# Altium schematic sheet SheetADC.SchDoc
size A
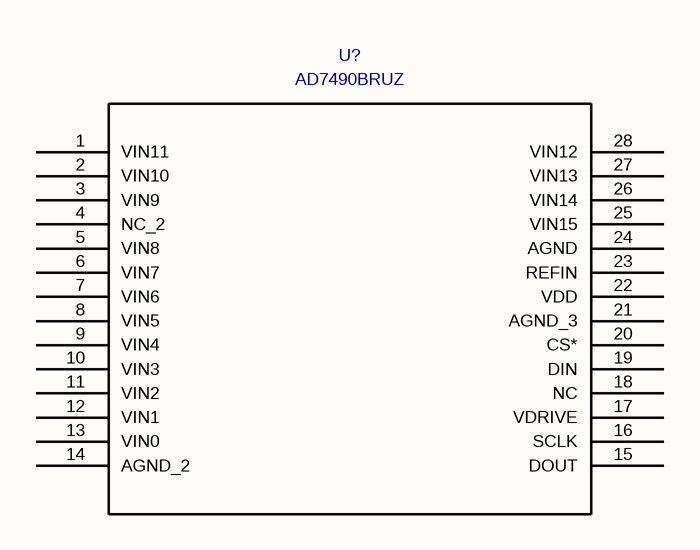
[diagram p0: SheetADC.SchDoc]

## Parts
U?  AD7490BRUZ  [RU_28]

## Nets

Not connected (* = marked no-connect by the designer): U? 1(VIN11) 2(VIN10) 3(VIN9) 4(NC_2) 5(VIN8) 6(VIN7) 7(VIN6) 8(VIN5) 9(VIN4) 10(VIN3) 11(VIN2) 12(VIN1) 13(VIN0) 14(AGND_2) 15(DOUT) 16(SCLK) 17(VDRIVE) 18(NC) 19(DIN) 20(CS*) 21(AGND_3) 22(VDD) 23(REFIN) 24(AGND) 25(VIN15) 26(VIN14) 27(VIN13) 28(VIN12)

## Library data of the parts
U? = AD7490BRUZ: C: Copyright (C) 2015 Accelerated Designs. All rights reserved; Vendor: Analog Devices Inc; Built_By: EMA_UL_Team; Value: AD7490BRUZ; Manufacturer_Part_Number: AD7490BRUZ